# EasyEDA schematic 3yp_project.json

## Sheets
1 Sheet_1: TITLE: Sheet_1; REV: 1.0; Date: 2023-01-07; Sheet: 1/1; Drawn By: e18077; Company: Your Company
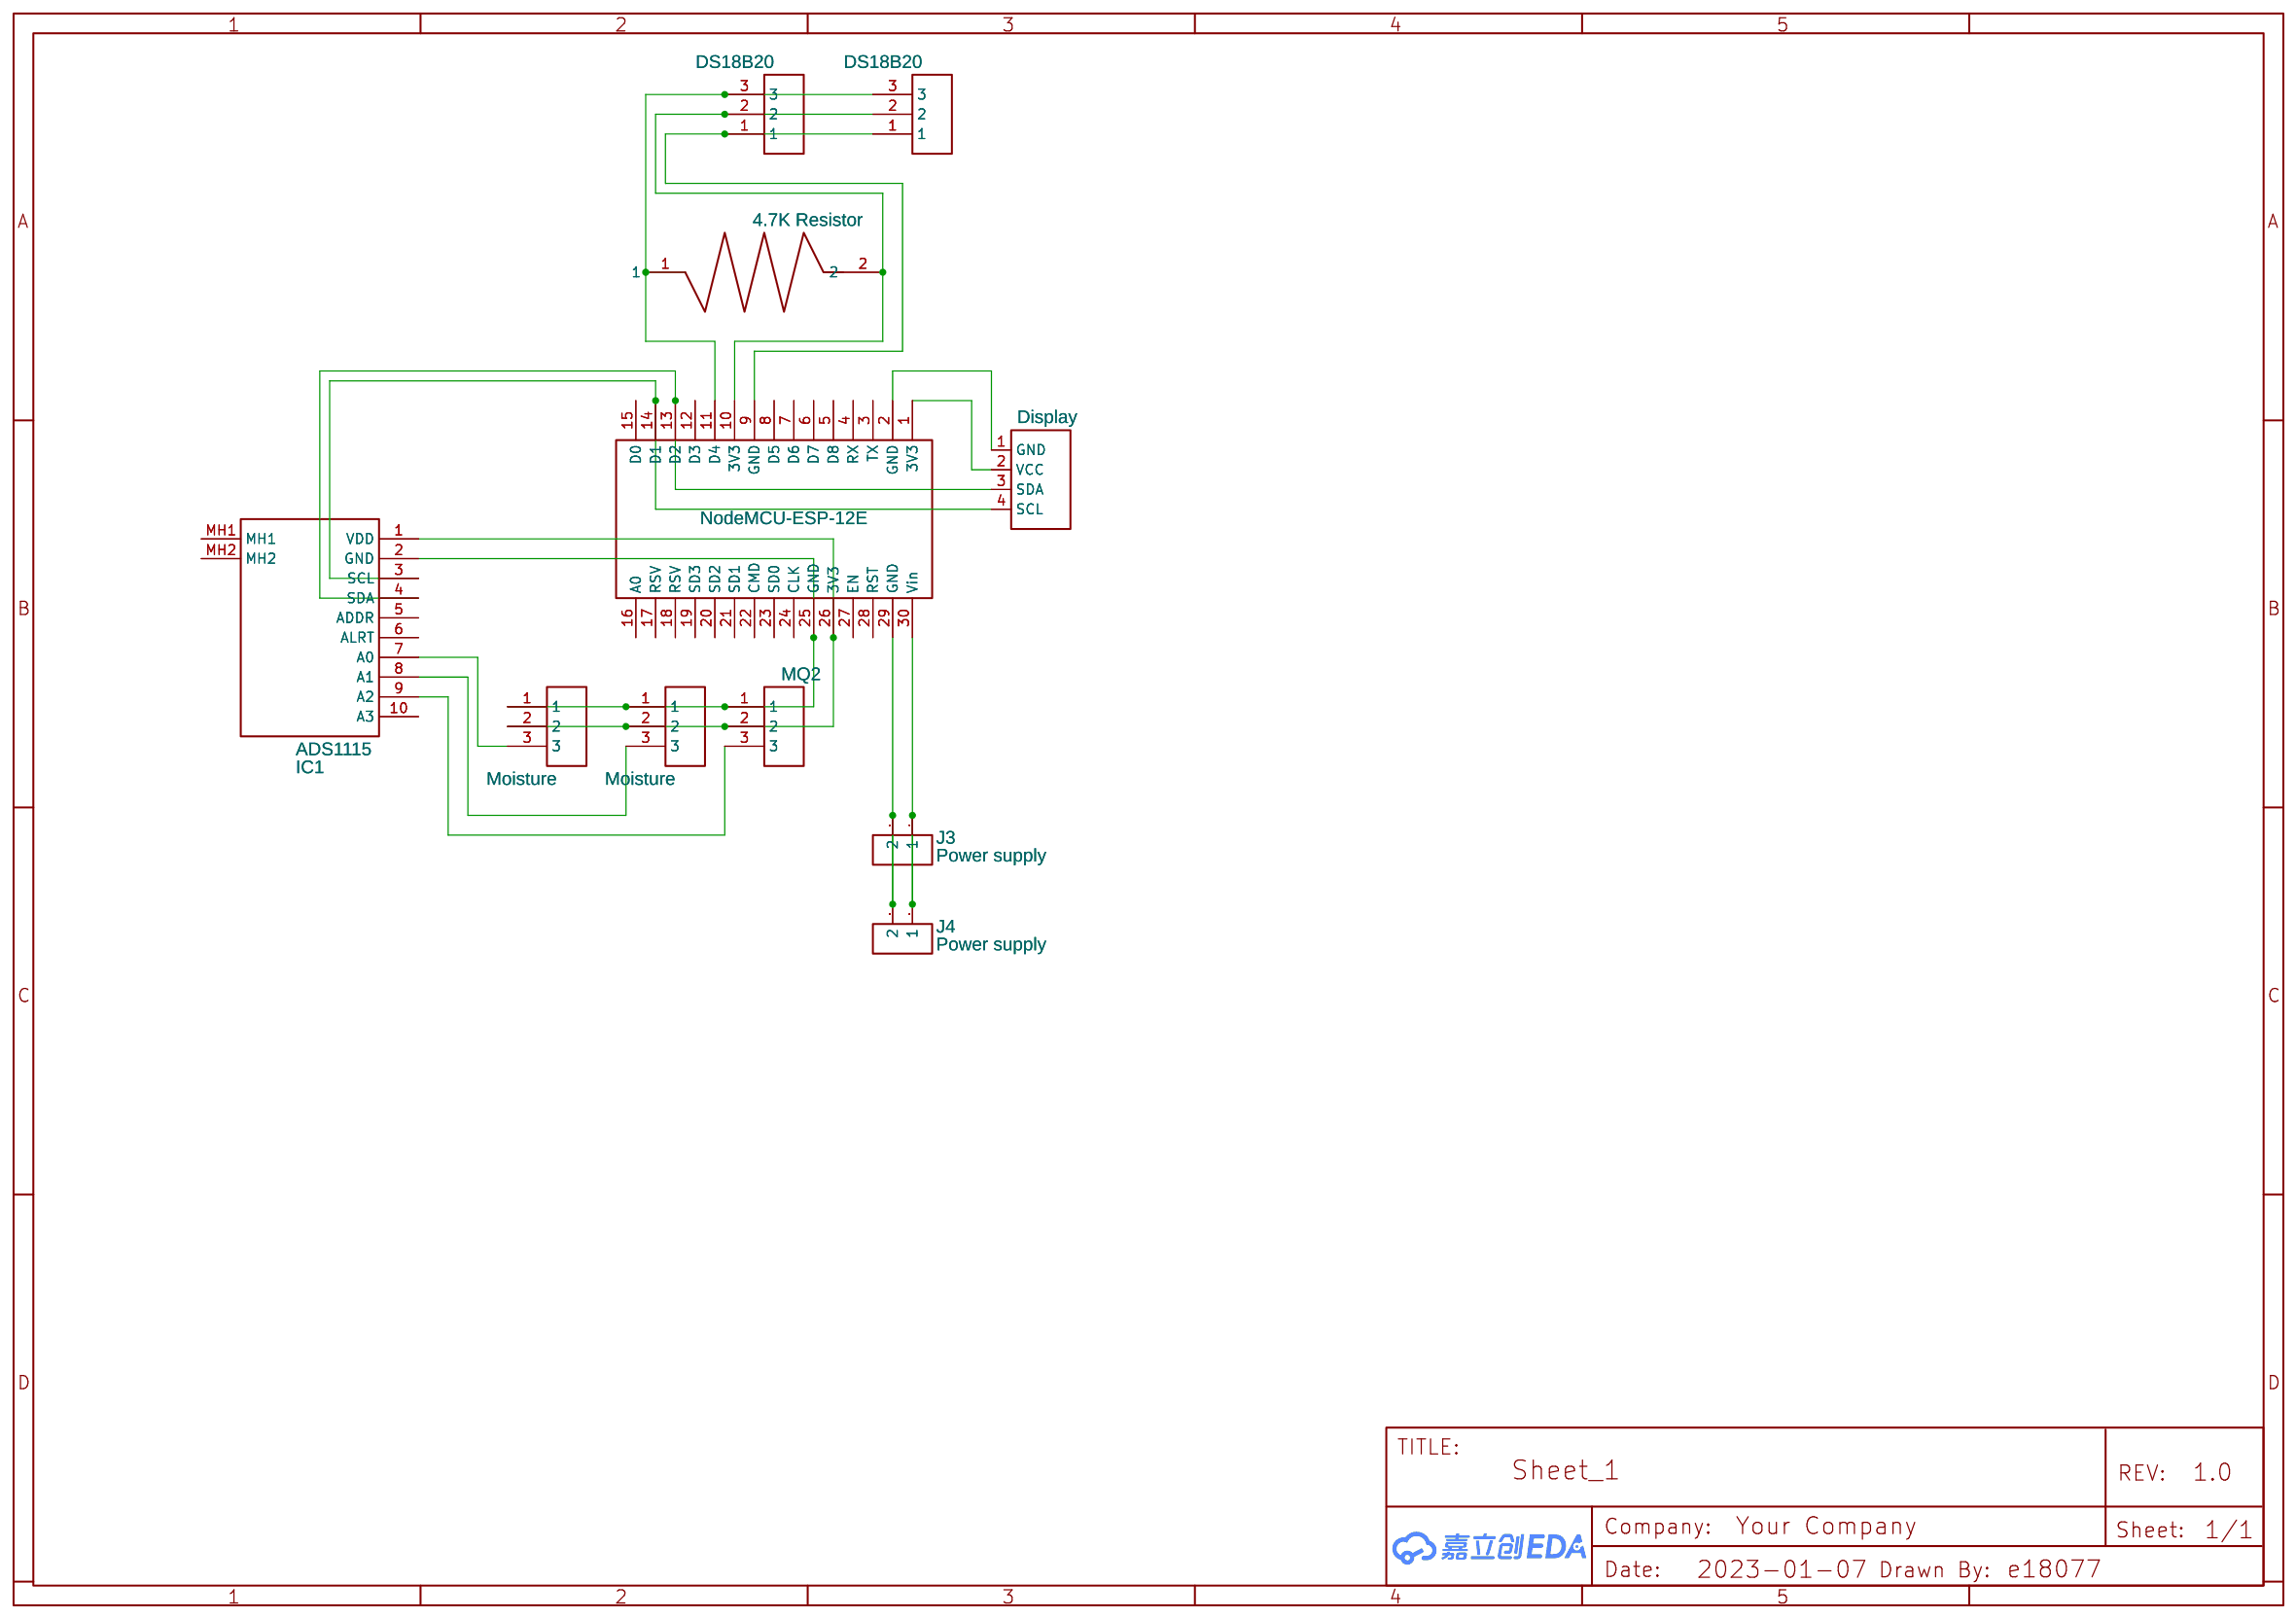
[diagram p0: Sheet_1]
2 Sheet_2: TITLE: Sheet_2
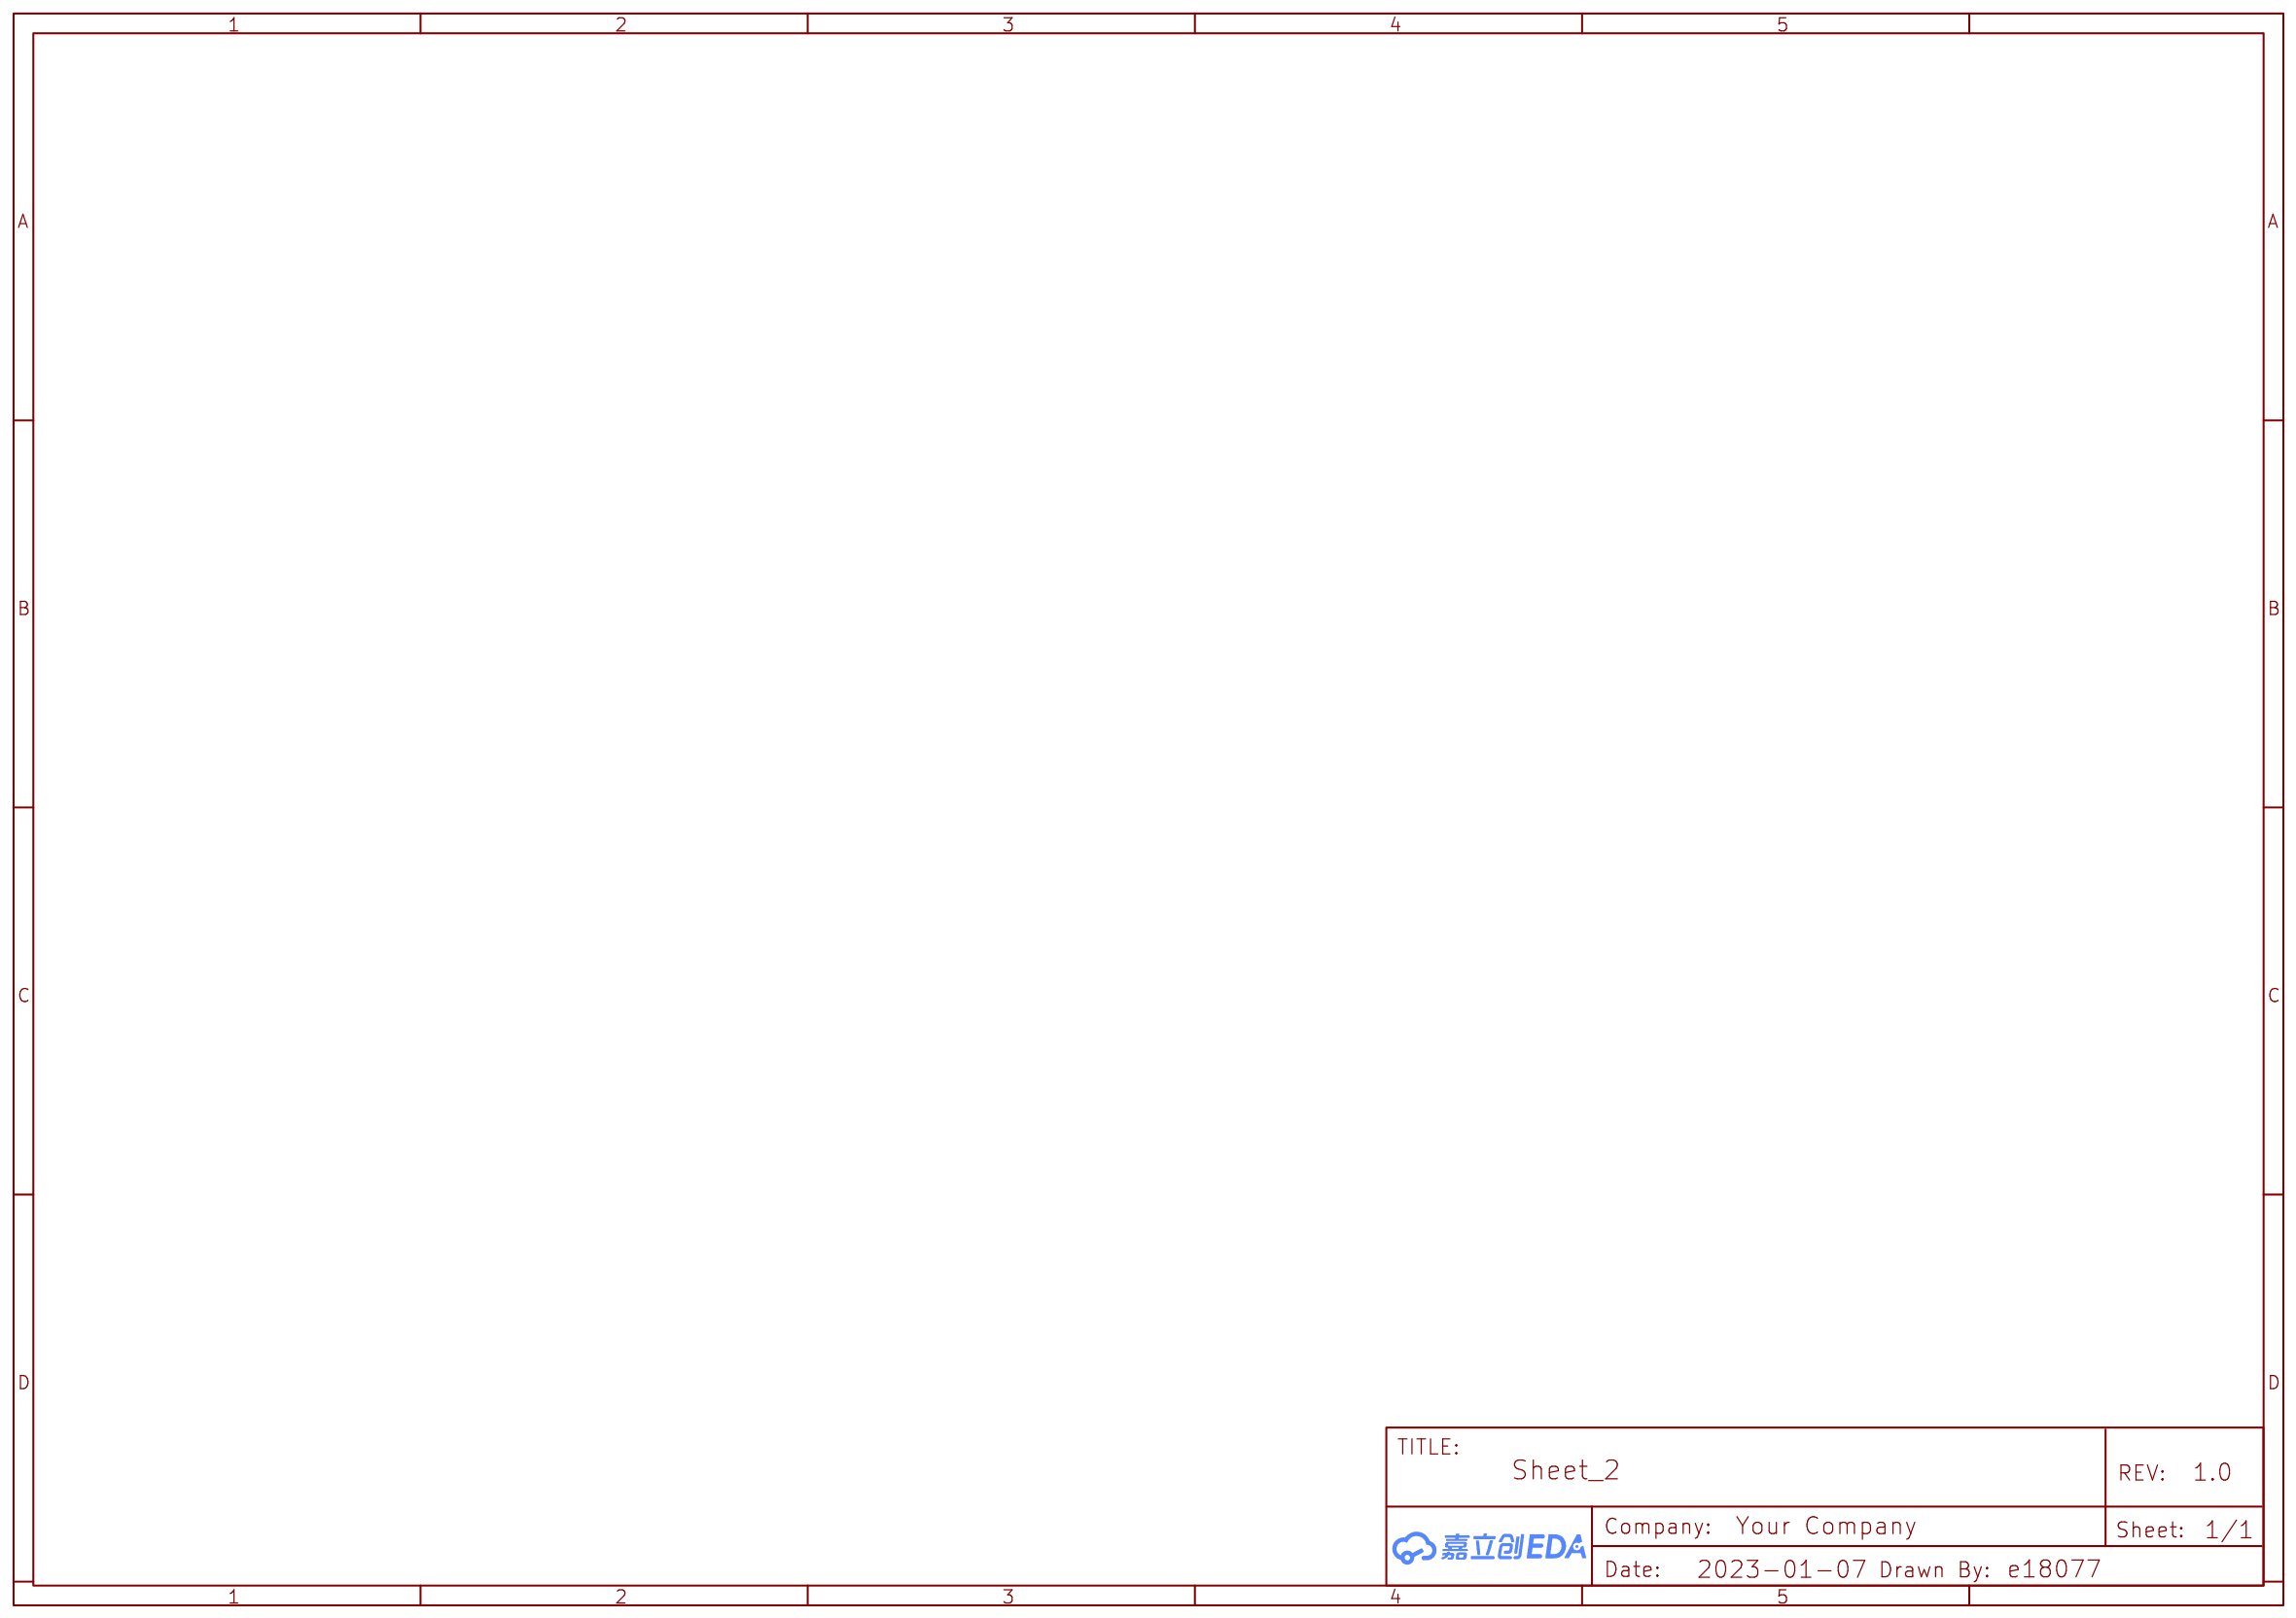
[diagram p1: Sheet_2]

## Parts
H1  Display  [I2C_HEADER LOWCOMOCO GND/VCC/SCL/SDA]
H4  DS18B20  [HEADER-3PIN]
H5  DS18B20  [HEADER-3PIN]
H6  MQ2  [HEADER-3PIN]
H7  Moisture  [HEADER-3PIN]
H8  Moisture  [HEADER-3PIN]
IC1  ADS1115  [ADS1115]
J3  Power supply  [CONNECTOR_PINHEADER_2.54MM:PINHEADER_1X11_P_2.54MM]
J4  Power supply  [CONNECTOR_PINHEADER_2.54MM:PINHEADER_1X11_P_2.54MM]
U1  NodeMCU-ESP-12E  [NODEMCU-ESP-12E]
U2  4.7K Resistor  [4.7K RESISTOR]

## Library data of the parts
H1 = I2C_HEADER LOWCOMOCO GND/VCC/SCL/SDA: Contributor: fabio.978
H4-H8 = HEADER-3PIN: Contributor: Torbsi
IC1 = ADS1115: Contributor: Lorys
J3 J4 = HEADER PAD 2X: Manufacturer: BOOMELE; Manufacturer Part: Female headerHDR1X8-2.54; Supplier Part: C27438; JLCPCB Part Class: Extended Part; Contributor: Kristiāns Gaspersons
U1 = NodeMCU-ESP-12E: Contributor: olsenart
U2 = 4.7K Resistor: Contributor: itsHolden

## Nets
Net-(H1-1): H1.1(GND) U1.2(GND)
Net-(H1-2): H1.2(VCC) U1.1(3V3)
Net-(H1-3): H1.3(SDA) IC1.4(SDA) U1.13(D2)
Net-(H1-4): H1.4(SCL) IC1.3(SCL) U1.14(D1)
Net-(H4-1): H4.1 H5.1 U1.9(GND)
Net-(H4-2): H4.2 H5.2 U1.10(3V3) U2.2
Net-(H4-3): H4.3 H5.3 U1.11(D4) U2.1
Net-(H6-1): H6.1 H7.1 H8.1 IC1.2(GND) U1.25(GND)
Net-(H6-2): H6.2 H7.2 H8.2 IC1.1(VDD) U1.26(3V3)
Net-(H6-3): H6.3 IC1.9(A2)
Net-(H7-3): H7.3 IC1.8(A1)
Net-(H8-3): H8.3 IC1.7(A0)
Net-(J3-1): J3.1 J4.1 U1.30(Vin)
Net-(J3-2): J3.2 J4.2 U1.29(GND)

Not connected (* = marked no-connect by the designer): IC1 5(ADDR) 6(ALRT) 10(A3) MH1 MH2; U1 3(TX) 4(RX) 5(D8) 6(D7) 7(D6) 8(D5) 12(D3) 15(D0) 16(A0) 17(RSV) 18(RSV) 19(SD3) 20(SD2) 21(SD1) 22(CMD) 23(SD0) 24(CLK) 27(EN) 28(RST)
